# EAGLE design ZED-F9P_NEO-D9S_Combo (EAGLE 9.6.2)
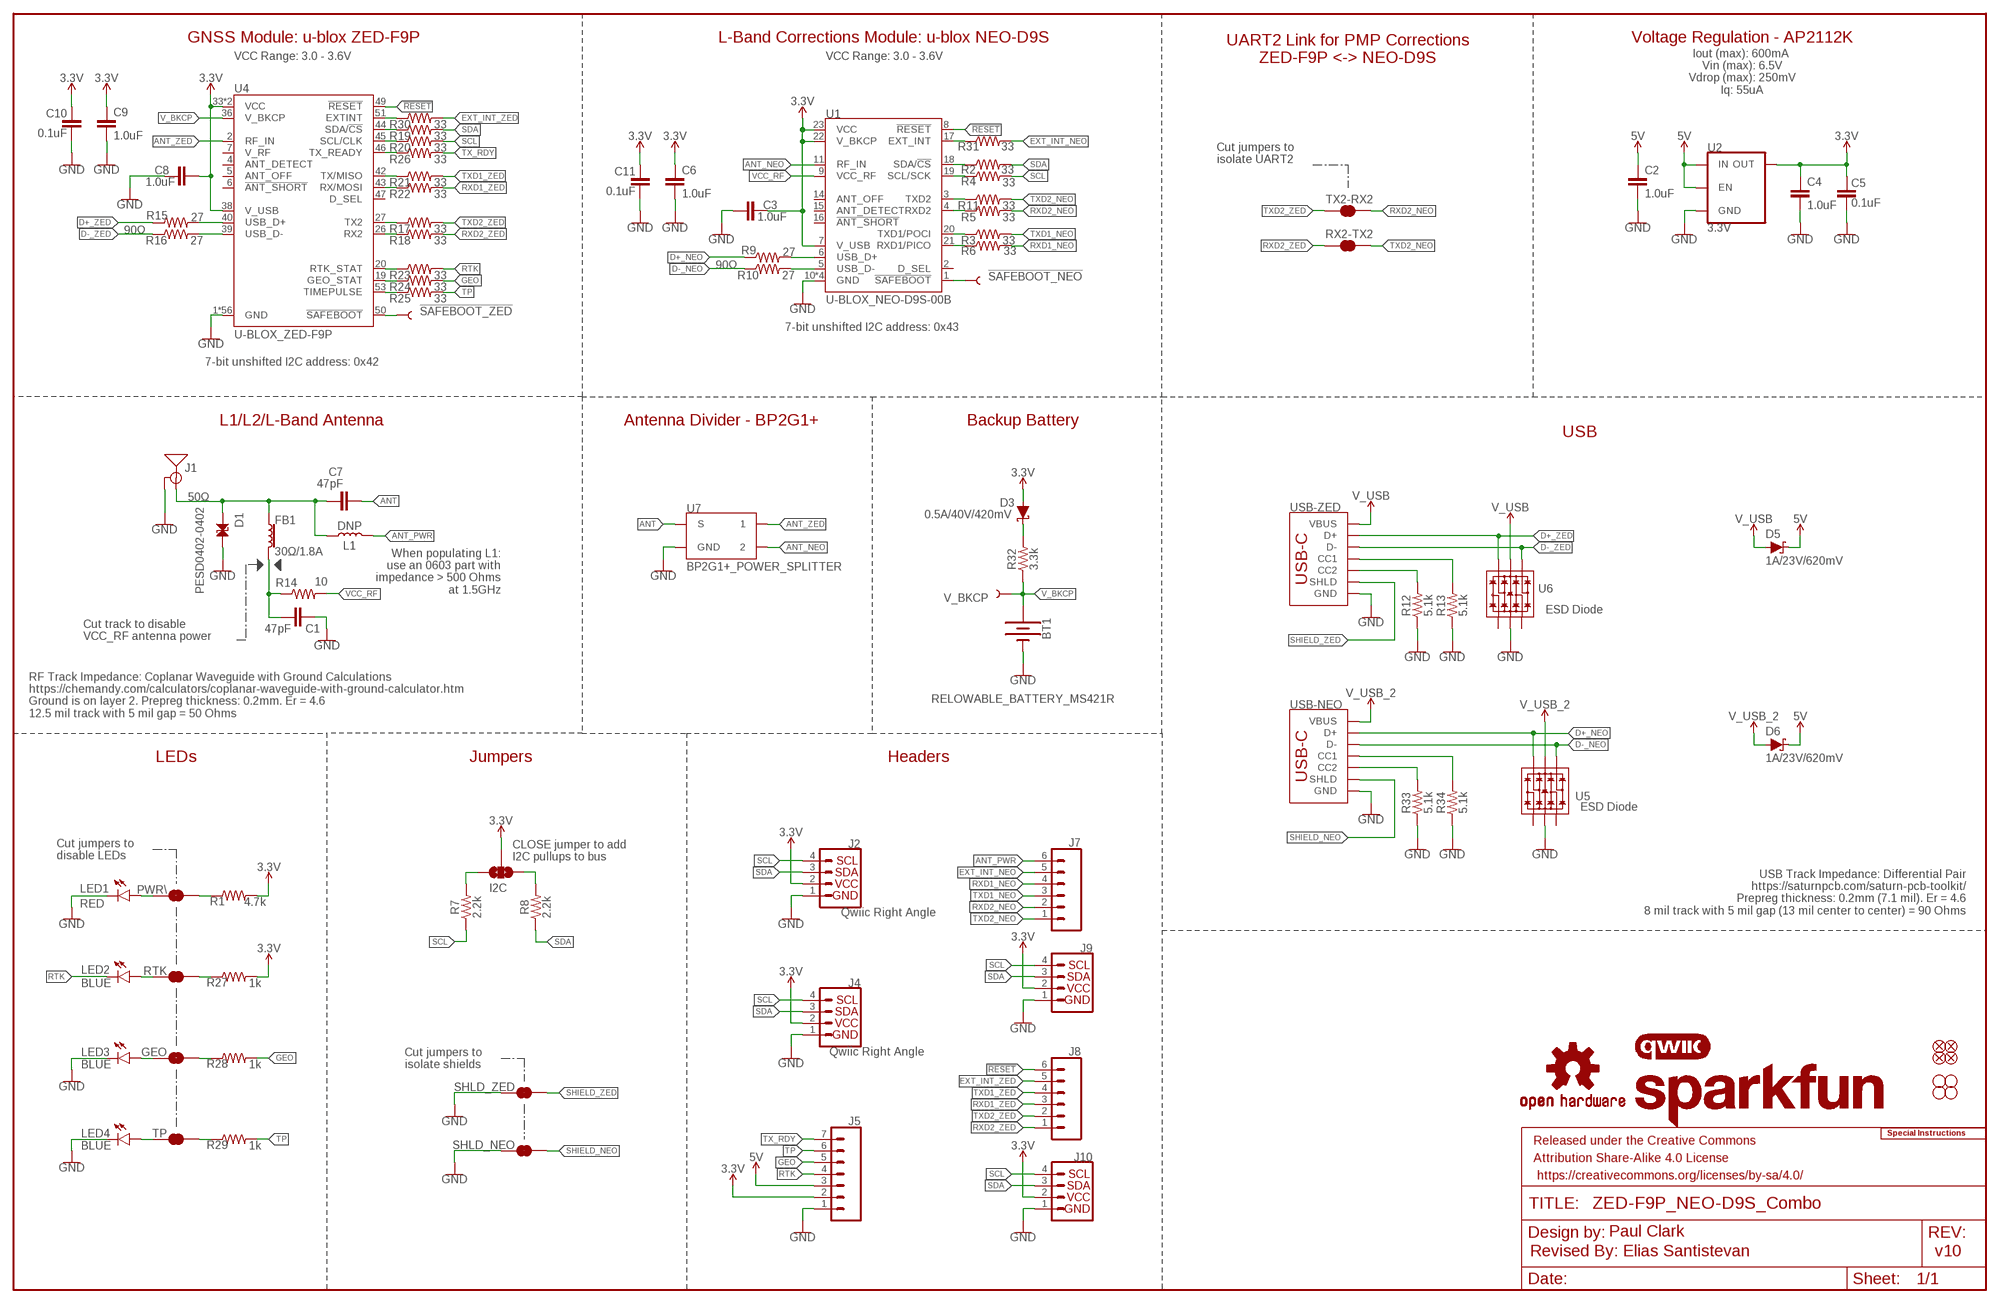
[diagram p0: schematic, sheet 1]

## Parts
!SAFEBOOT_NEO!  TEST-POINTPOGO_PTH  [1X01_NO_SILK]
!SAFEBOOT_ZED!  TEST-POINTPOGO_PTH  [1X01_NO_SILK]
BT1  RELOWABLE_BATTERY_MS421R  [MS421R_IV03E]
C1  47pF  47PF-0603-50V-5%  [0603]
C2  1.0uF  1.0UF-0603-16V-10%  [0603]
C3  1.0uF  1.0UF-0603-16V-10%  [0603]
C4  1.0uF  1.0UF-0603-16V-10%  [0603]
C5  0.1uF  0.1UF-0603-25V-(+80/-20%)  [0603]
C6  1.0uF  1.0UF-0603-16V-10%  [0603]
C7  47pF  47PF-0603-50V-5%  [0603]
C8  1.0uF  1.0UF-0603-16V-10%  [0603]
C9  1.0uF  1.0UF-0603-16V-10%  [0603]
C10  0.1uF  0.1UF-0603-25V-(+80/-20%)  [0603]
C11  0.1uF  0.1UF-0603-25V-(+80/-20%)  [0603]
D1  PESD0402-0402  [0402]
D3  0.5A/40V/420mV  DIODE-SCHOTTKY-PMEG4005EJ  [SOD-323]
D5  1A/23V/620mV  DIODE-SCHOTTKY-BAT20J  [SOD-323]
D6  1A/23V/620mV  DIODE-SCHOTTKY-BAT20J  [SOD-323]
FB1  30Ω/1.8A  FERRITE_BEAD-0603  [0603]
FRAME2  FRAME-LEDGER  [CREATIVE_COMMONS]
GEO  JUMPER-SMT_2_NC_TRACE_SILK  [SMT-JUMPER_2_NC_TRACE_SILK]
I2C  JUMPER-SMT_3_NO_SILK  [SMT-JUMPER_3_NO_SILK]
J1  ANTENNA-SMA-GROUNDEDEDGE_SMA  [SMA-EDGE]
J2  Qwiic Right Angle  I2C_STANDARDQWIIC  [JST04_1MM_RA]
J4  Qwiic Right Angle  I2C_STANDARDQWIIC  [JST04_1MM_RA]
J5  CONN_07NO_SILK  [1X07_NO_SILK]
J7  CONN_06NO_SILK_NO_POP  [1X06_NO_SILK]
J8  CONN_06NO_SILK_NO_POP  [1X06_NO_SILK]
J9  I2C_STANDARD_NO_SILK  [1X04_NO_SILK]
J10  I2C_STANDARD_NO_SILK  [1X04_NO_SILK]
JP21  FIDUCIALUFIDUCIAL  [MICRO-FIDUCIAL]
JP31  STAND-OFF  [STAND-OFF]
JP41  STAND-OFF  [STAND-OFF]
JP61  FIDUCIALUFIDUCIAL  [MICRO-FIDUCIAL]
JP71  FIDUCIALUFIDUCIAL  [MICRO-FIDUCIAL]
JP81  FIDUCIALUFIDUCIAL  [MICRO-FIDUCIAL]
JP91  STAND-OFF  [STAND-OFF]
JP101  STAND-OFF  [STAND-OFF]
L1  DNP  DNP-0603_NO-CREAM  [0603_NO-CREAM]
LED1  RED  LED-RED_0603-KB  [LED-0603]
LED2  BLUE  LED-BLUE0603  [LED-0603]
LED3  BLUE  LED-BLUE0603  [LED-0603]
LED4  BLUE  LED-BLUE0603  [LED-0603]
LOGO2  SFE_LOGO_NAME.1_INCH  [SFE_LOGO_NAME_.1]
LOGO3  QWIIC_LOGO_5MM  [QWIIC_5MM]
LOGO4  OSHW-LOGOS  [OSHW-LOGO-S]
LOGO5  SPECIAL_INSTRUCTIONS-ORDERING  [ORDERING_INSTRUCTIONS]
PWR\  JUMPER-SMT_2_NC_TRACE_SILK  [SMT-JUMPER_2_NC_TRACE_SILK]
R1  4.7k  4.7KOHM-0603-1/10W-1%  [0603]
R2  33  33OHM-0603-1/10W-1%  [0603]
R3  33  33OHM-0603-1/10W-1%  [0603]
R4  33  33OHM-0603-1/10W-1%  [0603]
R5  33  33OHM-0603-1/10W-1%  [0603]
R6  33  33OHM-0603-1/10W-1%  [0603]
R7  2.2k  2.2KOHM-0603-1/10W-1%  [0603]
R8  2.2k  2.2KOHM-0603-1/10W-1%  [0603]
R9  27  27OHM-0603-1/10W-1%  [0603]
R10  27  27OHM-0603-1/10W-1%  [0603]
R11  33  33OHM-0603-1/10W-1%  [0603]
R12  5.1k  5.1KOHM5.1KOHM-0603-1/10W-1%  [0603]
R13  5.1k  5.1KOHM5.1KOHM-0603-1/10W-1%  [0603]
R14  10  10OHM-0603-1/10W-1%  [0603]
R15  27  27OHM-0603-1/10W-1%  [0603]
R16  27  27OHM-0603-1/10W-1%  [0603]
R17  33  33OHM-0603-1/10W-1%  [0603]
R18  33  33OHM-0603-1/10W-1%  [0603]
R19  33  33OHM-0603-1/10W-1%  [0603]
R20  33  33OHM-0603-1/10W-1%  [0603]
R21  33  33OHM-0603-1/10W-1%  [0603]
R22  33  33OHM-0603-1/10W-1%  [0603]
R23  33  33OHM-0603-1/10W-1%  [0603]
R24  33  33OHM-0603-1/10W-1%  [0603]
R25  33  33OHM-0603-1/10W-1%  [0603]
R26  33  33OHM-0603-1/10W-1%  [0603]
R27  1k  1KOHM-0603-1/10W-1%  [0603]
R28  1k  1KOHM-0603-1/10W-1%  [0603]
R29  1k  1KOHM-0603-1/10W-1%  [0603]
R30  33  33OHM-0603-1/10W-1%  [0603]
R31  33  33OHM-0603-1/10W-1%  [0603]
R32  3.3k  3.3KOHM-0603-1/10W-1%  [0603]
R33  5.1k  5.1KOHM5.1KOHM-0603-1/10W-1%  [0603]
R34  5.1k  5.1KOHM5.1KOHM-0603-1/10W-1%  [0603]
RTK  JUMPER-SMT_2_NC_TRACE_SILK  [SMT-JUMPER_2_NC_TRACE_SILK]
RX2-TX2  JUMPER-SMT_2_NC_TRACE_SILK  [SMT-JUMPER_2_NC_TRACE_SILK]
SHLD_NEO  JUMPER-SMT_2_NC_TRACE_SILK  [SMT-JUMPER_2_NC_TRACE_SILK]
SHLD_ZED  JUMPER-SMT_2_NC_TRACE_SILK  [SMT-JUMPER_2_NC_TRACE_SILK]
TP  JUMPER-SMT_2_NC_TRACE_SILK  [SMT-JUMPER_2_NC_TRACE_SILK]
TX2-RX2  JUMPER-SMT_2_NC_TRACE_SILK  [SMT-JUMPER_2_NC_TRACE_SILK]
U1  U-BLOX_NEO-D9S-00B  [NEO-M9N/M8T/M8U/D9S]
U2  3.3V  V_REG_AP2112K-3.3V  [SOT23-5]
U4  U-BLOX_ZED-F9P  [ZED-F9P]
U5  ESD Diode  TVS_DIODE_ARRAY_DT1042-04SO-7  [SOT-23-6]
U6  ESD Diode  TVS_DIODE_ARRAY_DT1042-04SO-7  [SOT-23-6]
U7  BP2G1+_POWER_SPLITTER  [XX21]
USB-NEO  USB Female Type C Connector  USB_C_4-LAYER_PADS  [USB-C-16P_4LAYER-PADS]
USB-ZED  USB Female Type C Connector  USB_C_4-LAYER_PADS  [USB-C-16P_4LAYER-PADS]
V_BKCP  TEST-POINT3X5  [PAD.03X.05]

## Nets
3.3V [3.3V]: C3.1 C4.1 C5.2 C6.1 C8.2 C9.1 C10.2 C11.2 D3.A I2C.2 J2.2 J4.2 J5.2 J9.2 J10.2 R1.2 R27.2 U1.7(V_USB) U1.22(V_BKCP) U1.23(VCC) U2.5(OUT) U4.33(VCC) U4.34(VCC) U4.38(V_USB)
5V: C2.1 D5.C D6.C J5.3 U2.1(IN) U2.3(EN)
!RESET!: J8.6 U1.8(!RESET!) U4.49(!RESET!)
!SAFEBOOT_NEO!: !SAFEBOOT_NEO!.1 U1.1(!SAFEBOOT!)
!SAFEBOOT_ZED!: !SAFEBOOT_ZED!.1 U4.50(!SAFEBOOT!)
ANT: C7.2 U7.2(S)
ANT_NEO: U1.11(RF_IN) U7.5
ANT_PWR: J7.6 L1.2
ANT_VCC: C1.1 FB1.2 R14.1
ANT_ZED: U4.2(RF_IN) U7.8
D+_NEO [DiffPair]: R9.1 U5.6(IO4) USB-NEO.A6(D+) USB-NEO.B6(D+)
D+_ZED [DiffPair]: R15.1 U6.6(IO4) USB-ZED.A6(D+) USB-ZED.B6(D+)
D-_NEO [DiffPair]: R10.1 U5.4(IO3) USB-NEO.A7(D-) USB-NEO.B7(D-)
D-_ZED [DiffPair]: R16.1 U6.4(IO3) USB-ZED.A7(D-) USB-ZED.B7(D-)
EXT_INT_NEO: J7.5 R31.2
EXT_INT_ZED: J8.5 R30.2
GEO: J5.5 R24.2 R28.2
GND: BT1.- C1.2 C2.2 C3.2 C4.2 C5.1 C6.2 C8.1 C9.2 C10.1 C11.1 D1.2 J1.GND@0(GND) J1.GND@1(GND) J1.GND@2(GND) J1.GND@3(GND) J2.1 J4.1 J5.1 J9.1 J10.1 LED1.C LED3.C LED4.C R12.1 R13.1 R33.1 R34.1 SHLD_NEO.1 SHLD_ZED.1 U1.10(GND) U1.12(GND) U1.13(GND) U1.24(GND) U2.2(GND) U4.1(GND) U4.3(GND) U4.12(GND) U4.14(GND) U4.32(GND) U4.37(GND) U4.41(GND) U4.48(GND) U4.55(GND) U4.56(GND) U4.57(GND) U4.58(GND) U4.59(GND) U4.60(GND) U4.61(GND) U4.62(GND) U4.63(GND) U4.64(GND) U4.65(GND) U4.66(GND) U4.67(GND) U4.68(GND) U4.69(GND) U4.70(GND) U4.71(GND) U4.72(GND) U4.73(GND) U4.74(GND) U4.75(GND) U4.76(GND) U4.77(GND) U4.78(GND) U4.79(GND) U4.80(GND) U4.81(GND) U4.82(GND) U4.83(GND) U4.84(GND) U4.85(GND) U4.86(GND) U4.87(GND) U4.88(GND) U4.89(GND) U4.90(GND) U4.91(GND) U4.92(GND) U4.93(GND) U4.94(GND) U4.95(GND) U4.96(GND) U4.97(GND) U4.98(GND) U4.99(GND) U4.100(GND) U4.101(GND) U4.102(GND) U5.2(VSS) U6.2(VSS) U7.1(GND) U7.3(GND) U7.4(GND) U7.6(GND) U7.7(GND) USB-NEO.GND USB-NEO.GND2(GND) USB-ZED.GND USB-ZED.GND2(GND)
N$1: PWR\.2 R1.1
N$2: R3.1 U1.20(TXD1/POCI)
N$3: R2.1 U1.18(SDA/!CS!)
N$4: R4.1 U1.19(SCL/SCK)
N$5: I2C.1 R8.2
N$6: R6.1 U1.21(RXD1/PICO)
N$7: R12.2 USB-ZED.B5(CC2)
N$8: I2C.3 R7.2
N$9: R13.2 USB-ZED.A5(CC1)
N$10: LED1.A PWR\.1
N$11: R9.2 U1.6(USB_D+)
N$12: R10.2 U1.5(USB_D-)
N$13: D3.C R32.2
N$14: R11.1 U1.3(TXD2)
N$15: R5.1 U1.4(RXD2)
N$16: R15.2 U4.40(USB_D+)
N$17: R16.2 U4.39(USB_D-)
N$18: R19.1 U4.44(SDA/!CS!)
N$19: R20.1 U4.45(SCL/CLK)
N$20: R21.1 U4.42(TX/MISO)
N$21: R22.1 U4.43(RX/MOSI)
N$22: R26.1 U4.46(TX_READY)
N$23: LED2.A RTK.1
N$24: R17.1 U4.27(TX2)
N$25: R18.1 U4.26(RX2)
N$26: GEO.1 LED3.A
N$27: LED4.A TP.1
N$28: R27.1 RTK.2
N$29: GEO.2 R28.1
N$30: R29.1 TP.2
N$31: R30.1 U4.51(EXTINT)
N$32: R31.1 U1.17(EXT_INT)
N$33: R33.2 USB-NEO.B5(CC2)
N$34: R34.2 USB-NEO.A5(CC1)
N$35: R23.1 U4.20(RTK_STAT)
N$36: R24.1 U4.19(GEO_STAT)
N$37: R25.1 U4.53(TIMEPULSE)
RTK: J5.4 LED2.C R23.2
RXD1_NEO: J7.4 R6.2
RXD1_ZED: J8.3 R22.2
RXD2_NEO: J7.2 R5.2 TX2-RX2.2
RXD2_ZED: J8.1 R18.2 RX2-TX2.1
SCL: J2.4 J4.4 J9.4 J10.4 R4.2 R7.1 R20.2
SDA: J2.3 J4.3 J9.3 J10.3 R2.2 R8.1 R19.2
SHIELD_NEO: SHLD_NEO.2 USB-NEO.SHLD1(SHLD) USB-NEO.SHLD2(SHLD) USB-NEO.SHLD3(SHLD) USB-NEO.SHLD4(SHLD)
SHIELD_ZED: SHLD_ZED.2 USB-ZED.SHLD1(SHLD) USB-ZED.SHLD2(SHLD) USB-ZED.SHLD3(SHLD) USB-ZED.SHLD4(SHLD)
SMA: C7.1 D1.1 FB1.1 J1.SIG(SIGNAL) L1.1
TP: J5.6 R25.2 R29.2
TX_RDY: J5.7 R26.2
TXD1_NEO: J7.3 R3.2
TXD1_ZED: J8.4 R21.2
TXD2_NEO: J7.1 R11.2 RX2-TX2.2
TXD2_ZED: J8.2 R17.2 TX2-RX2.1
V_BKCP: BT1.+ R32.1 U4.36(V_BKCP) V_BKCP.1
V_USB: D5.A U6.5(VCC) USB-ZED.VBUS1(VBUS) USB-ZED.VBUS2(VBUS)
V_USB_2: D6.A U5.5(VCC) USB-NEO.VBUS1(VBUS) USB-NEO.VBUS2(VBUS)
VCC_RF: R14.2 U1.9(VCC_RF)
Unconnected: U1.2(D_SEL) U1.14(ANT_OFF) U1.15(ANT_DETECT) U1.16(!ANT_SHORT!) U4.4(ANT_DETECT) U4.5(ANT_OFF) U4.6(!ANT_SHORT!) U4.7(V_RF) U4.47(D_SEL) U5.1(IO1) U5.3(IO2) U6.1(IO1) U6.3(IO2)

## Notes on the sheet
- GNSS Module: u-blox ZED-F9P | L-Band Corrections Module: u-blox NEO-D9S | Voltage Regulation - AP2112K
- UART2 Link for PMP Corrections
  ZED-F9P <-> NEO-D9S
- VCC Range: 3.0 - 3.6V | VCC Range: 3.0 - 3.6V
- Iout (max): 600mA 
  Vin (max): 6.5V
  Vdrop (max): 250mV
  Iq: 55uA
- Cut jumpers to
  isolate UART2
- 90Ω
- 90Ω
- 7-bit unshifted I2C address: 0x43
- 7-bit unshifted I2C address: 0x42
- L1/L2/L-Band Antenna | Antenna Divider - BP2G1+ | Backup Battery
- USB
- 50Ω
- When populating L1:
  use an 0603 part with
  impedance > 500 Ohms
  at 1.5GHz
- Cut track to disable
  VCC_RF antenna power
- RF Track Impedance: Coplanar Waveguide with Ground Calculations
  https://chemandy.com/calculators/coplanar-waveguide-with-ground-calculator.htm
  Ground is on layer 2. Prepreg thickness: 0.2mm. Er = 4.6
  12.5 mil track with 5 mil gap = 50 Ohms
- LEDs | Jumpers | Headers
- Cut jumpers to 
  disable LEDs
- CLOSE jumper to add
  I2C pullups to bus
- USB Track Impedance: Differential Pair
  https://saturnpcb.com/saturn-pcb-toolkit/
  Prepreg thickness: 0.2mm (7.1 mil). Er = 4.6
  8 mil track with 5 mil gap (13 mil center to center) = 90 Ohms
- Cut jumpers to 
  isolate shields
- Paul Clark
- Revised By: Elias Santistevan | v10

## Library data of the parts
!SAFEBOOT_NEO! !SAFEBOOT_ZED! V_BKCP = SparkFun-Connectors:TEST-POINT: SparkFun Test Points Bare copper test points for troubleshooting or In-Circuit-Testing. These are used by our Production team for verifying production board runs using pogo-pins on test beds. SparkFun Products: SparkFun LSM9DS1 Breakout <https://www.sparkfun.com/products/13284> SparkFun PSOC <https://www.sparkfun.com/products/13714> SparkFun Load Cell Amplifier <https://www.sparkfun.com/products/13879>
BT1 = SparkFun-Batteries:RELOWABLE_BATTERY: SEIKO Reflowable Lithium Batteries; PROD_ID: BAT-16685
C1 C7 = SparkFun-Capacitors:47PF: 47pF ceramic capacitors A capacitor is a passive two-terminal electrical component used to store electrical energy temporarily in an electric field.; PROD_ID: CAP-08913
C2-C4 C6 C8 C9 = SparkFun-Capacitors:1.0UF: 1µF ceramic capacitors A capacitor is a passive two-terminal electrical component used to store electrical energy temporarily in an electric field.; PROD_ID: CAP-00868
C5 C10 C11 = SparkFun-Capacitors:0.1UF: 0.1µF ceramic capacitors A capacitor is a passive two-terminal electrical component used to store electrical energy temporarily in an electric field.; PROD_ID: CAP-00810
D1 = SparkFun-DiscreteSemi:PESD0402: ESD protection diode PESD is used to protect a signal line from ESD.; DIGIKEY_PART: PESD0402-140CT-ND; MOUSE_PART: 650-PESD0402-140; PROD_ID: DIO-15359
D3 = SparkFun-DiscreteSemi:DIODE-SCHOTTKY: Schottky diode A Schottky diode is a semiconductor diode which has a low forward voltage drop and a very fast switching action.; PROD_ID: DIO-10955
D5 D6 = SparkFun-DiscreteSemi:DIODE-SCHOTTKY: Schottky diode A Schottky diode is a semiconductor diode which has a low forward voltage drop and a very fast switching action.; PROD_ID: DIO-11623
FB1 = SparkFun-Coils:FERRITE_BEAD: Ferrite Bead (blocks, cores, rings, chokes, etc.) Inductor with layers of ferrite used to suppress high frequencies. Often used to isolate high frequency noise. SparkFun Products: IOIO-OTG - V2.2 <https://www.sparkfun.com/products/13613> SparkFun SAMD21 Mini Breakout <https://www.sparkfun.com/products/13664> SparkFun 6 Degrees of Freedom Breakout - LSM6DS3 <https://www.sparkfun.com/products/13339> SparkFun SAMD21 Dev Breakout <https://www.sparkfun.com/products/13672> Lilypad MP3 <https://www.sparkfun.com/products/11013>; PROD_ID: NDUC-13805
FRAME2 = SparkFun-Aesthetics:FRAME-LEDGER: Schematic Frame - Ledger Standard 11x14 US Ledger frame
GEO PWR\ RTK RX2-TX2 SHLD_NEO SHLD_ZED TP TX2-RX2 = SparkFun-Jumpers:JUMPER-SMT_2_NC_TRACE: Normally closed trace jumper This jumper has a trace between two pads so it's normally closed (NC). Use a razor knife to open the connection. For best results follow the IPC guidelines for cutting traces: Cutout at least 0.063 mm (0.005 in). Remove all loose material to clean up the cut area. Seal the cut with an approved epoxy. Reapply solder to reclose the connection.
I2C = SparkFun-Jumpers:JUMPER-SMT_3_NO: Normally open jumper This jumper has three pads in close proximity to each other. Apply solder to close the connection(s).
J1 = SparkFun-RF:ANTENNA-SMA-GROUNDED: SMA Antenna Connector w/ Ground Edge-mount and SMD SMA connectors for RF Antennas. **4-LAYER BOARD WARNING!!** When designing a 4-layer board using any of the SMD variants, you will need to manually add a cutout polygon on any internal power layers to make sure that you don't end up with exposed copper around the edge of the routed hole for these connectors. Exposed power copper could then short to the connector body - and that would be bad. Why hasn't anyone added the cutout polygons directly to the connector footprint? Well, your internal layers (usually 2 and 15) may be covered with GND polygons and you might well want the copper to go all the way to the edge, especially under the connector SIGNAL pin. So adding cutouts to the footprint might make matters worse, not better...; PROD_ID: CONN-08289
J2 J4 = SparkFun-Connectors:I2C_STANDARD: SparkFun I2C Standard Pinout Header SparkFun has standardized on a pinout for all I2C based sensor breakouts. This pinout allows I2C boards to be plugged directly into the headers on Arduino Uno compatible boards, and to be daisy chained easily. Example SparkFun Products: SparkFun Atmospheric Sensor Breakout - BME280 <https://www.sparkfun.com/products/13676> SparkFun Altitude/Pressure Sensor Breakout - MPL3115A2 <https://www.sparkfun.com/products/11084> SparkFun TOF Range Finder Sensor - VL6180 <https://www.sparkfun.com/products/12785>; PROD_ID: CONN-13694
J5 = SparkFun-Connectors:CONN_07: Multi connection point. Often used as Generic Header-pin footprint for 0.1 inch spaced/style header connections On any of the 0.1 inch spaced packages, you can populate with these: Break Away Headers - Straight <https://www.sparkfun.com/products/116> (PRT-00116) Break Away Male Headers - Right Angle <https://www.sparkfun.com/products/553> (PRT-00553) Female Headers <https://www.sparkfun.com/products/115> (PRT-00115) Break Away Headers - Machine Pin <https://www.sparkfun.com/products/117> (PRT-00117) Break Away Female Headers - Swiss Machine Pin <https://www.sparkfun.com/products/743> (PRT-00743) For SCREWTERMINALS and SPRING TERMINALS visit here: Screw Terimnals on SparkFun.com <https://www.sparkfun.com/search/results?term=Screw+Terminals> (5mm/3.5mm/2.54mm spacing) This device is also useful as a general connection point to wire up your design to another part of your project. Our various solder wires solder well into these plated through hole pads. Hook-Up Wire - Assortment (Stranded, 22 AWG) <https://www.sparkfun.com/products/11375> (PRT-11375) Hook-Up Wire - Assortment (Solid Core, 22 AWG) <https://www.sparkfun.com/products/11367> (PRT-11367) View the entire wire category on our website here <https://www.sparkfun.com/categories/141> Special notes: Molex polarized connector foot print use with SKU : PRT-08231 with associated crimp pins and housings. 1MM SMD Version SKU: PRT-10208 NOTES ON THE VARIANTS LOCK and LOCK_LONGPADS... This footprint was designed to help hold the alignment of a through-hole component (i.e. 6-pin header) while soldering it into place. You may notice that each hole has been shifted either up or down by 0.005 of an inch from it's more standard position (which is a perfectly straight line). This slight alteration caused the pins (the squares in the middle) to touch the edges of the holes. Because they are alternating, it causes a "brace" to hold the component in place. 0.005 has proven to be the perfect amount of "off-center" position when using our standard breakaway headers. Although looks a little odd when you look at the bare footprint, once you have a header in there, the alteration is very hard to notice. Also,if you push a header all the way into place, it is covered up entirely on the bottom side.
J7 J8 = SparkFun-Connectors:CONN_06: Multi connection point. Often used as Generic Header-pin footprint for 0.1 inch spaced/style header connections On any of the 0.1 inch spaced packages, you can populate with these: Break Away Headers - Straight <https://www.sparkfun.com/products/116> (PRT-00116) Break Away Male Headers - Right Angle <https://www.sparkfun.com/products/553> (PRT-00553) Female Headers <https://www.sparkfun.com/products/115> (PRT-00115) Break Away Headers - Machine Pin <https://www.sparkfun.com/products/117> (PRT-00117) Break Away Female Headers - Swiss Machine Pin <https://www.sparkfun.com/products/743> (PRT-00743) Arduino Stackable Header - 6 Pin <https://www.sparkfun.com/products/9280> (PRT-09280) Screw Terminals 2.54mm Pitch (6-Pin) <https://www.sparkfun.com/products/16499> (PRT-16499) For SCREWTERMINALS and SPRING TERMINALS visit here: Screw Terimnals on SparkFun.com <https://www.sparkfun.com/search/results?term=Screw+Terminals> (5mm/3.5mm/2.54mm spacing) This device is also useful as a general connection point to wire up your design to another part of your project. Our various solder wires solder well into these plated through hole pads. Hook-Up Wire - Assortment (Stranded, 22 AWG) <https://www.sparkfun.com/products/11375> (PRT-11375) Hook-Up Wire - Assortment (Solid Core, 22 AWG) <https://www.sparkfun.com/products/11367> (PRT-11367) View the entire wire category on our website here <https://www.sparkfun.com/categories/141>
J9 J10 = SparkFun-Connectors:I2C_STANDARD: SparkFun I2C Standard Pinout Header SparkFun has standardized on a pinout for all I2C based sensor breakouts. This pinout allows I2C boards to be plugged directly into the headers on Arduino Uno compatible boards, and to be daisy chained easily. Example SparkFun Products: SparkFun Atmospheric Sensor Breakout - BME280 <https://www.sparkfun.com/products/13676> SparkFun Altitude/Pressure Sensor Breakout - MPL3115A2 <https://www.sparkfun.com/products/11084> SparkFun TOF Range Finder Sensor - VL6180 <https://www.sparkfun.com/products/12785>
JP21 JP61 JP71 JP81 = SparkFun:FIDUCIAL: Fiducial Alignment Points Various fiducial points for machine vision alignment.
JP31 JP41 JP91 JP101 = SparkFun:STAND-OFF: Stand Off This is the mechanical footprint for a #4 phillips button head screw. Use the keepout ring to avoid running the screw head into surrounding components. SKU : PRT-00447
L1 = SparkFun-Coils:DNP
LED1 = SparkFun-LED:LED-RED: Red SMD LED Used in manufacturing of most products at SparkFun Packages: 0603 - KB - KingBright (DIO-17976) SMD 0603 package [Datasheet] <https://www.kingbrightusa.com/images/catalog/SPEC/APT1608SURCK.pdf> 0603 - (DIO-00819, has gone EOL) SMD 0603 package 0603 SMART - SMD 0603 SMART package ( more efficient and expensive)[Product Link] <http://www.osram-os.com/Graphics/XPic2/00077099_0.pdf> 1206 - SMD1206 package [Product Link] <https://www.sparkfun.com/datasheets/DevTools/LilyPad/Q150OVS4.pdff> SparkFun Products: Pro Mini 328 -5V <https://www.sparkfun.com/products/821> RedBoard <https://www.sparkfun.com/products/12757> IOIO-OTG <https://www.sparkfun.com/products/13613>; PROD_ID: DIO-17976
LED2-LED4 = SparkFun-LED:LED-BLUE: Blue SMD LED Used in manufacturing of various products at SparkFun Packages: 0603 - SMD 0603 package [Product Link] <http://www.digikey.com/product-detail/en/SMLE12BC7TT86/511-1589-2-ND/1641808> 1206 - SMD1206 package [Product Link] <http://www.digikey.com/product-detail/en/lite-on-inc/LTST-C150TBKT/160-1643-1-ND/573584> SparkFun Products: ESP8266 Thing-Dev Board <https://www.sparkfun.com/products/13711> RedBoard <https://www.sparkfun.com/products/12757>; PROD_ID: DIO-08575
LOGO2 = SparkFun-Aesthetics:SFE_LOGO_NAME: SparkFun Font Logo This is the SparkFun name logo. The logo on the schematic will always be the same size; the package variant is the height of the flame part of the logo (or the height the flame would be, if it were drawn). Default layer for the logo on the board is tSilk.
LOGO3 = SparkFun-Aesthetics:QWIIC_LOGO: Qwiic Logos for placement on schematic and PCB. The 5.5mm silk logo is best for placing next to Qwiic connector.
LOGO4 = SparkFun-Aesthetics:OSHW-LOGO: Open-Source Hardware (OSHW) Logo This logo indicates the piece of hardware it is found on incorporates a OSHW license and/or adheres to the definition of open source hardware found here: http://freedomdefined.org/OSHW
LOGO5 = SparkFun-Aesthetics:SPECIAL_INSTRUCTIONS: Special Ordering/Production Instructions Alert Symbol for special PCB ordering instructions or unique production process warnings. Ordering Instructions Production Instructions Types of information that should be added to box: Copper weight Soldermask color Silk color PCB thickness Number of layers PCB Standard: 1.6mm FR4 1 oz copper immersion silver plating red soldermask white silkscreen Types of information that should be added to box: Special wash requirements Depaneling instructions Humidification Glue curing Default text settings: 0.07 inch 9% ratio 50% line distance
R1 = SparkFun-Resistors:4.7KOHM: 4.7kΩ resistor A resistor is a passive two-terminal electrical component that implements electrical resistance as a circuit element. Resistors act to reduce current flow, and, at the same time, act to lower voltage levels within circuits. - Wikipedia; PROD_ID: RES-07857
R2-R6 R11 R17-R26 R30 R31 = SparkFun-Resistors:33OHM: 33Ω resistor A resistor is a passive two-terminal electrical component that implements electrical resistance as a circuit element. Resistors act to reduce current flow, and, at the same time, act to lower voltage levels within circuits. - Wikipedia; PROD_ID: RES-08270
R7 R8 = SparkFun-Resistors:2.2KOHM: 2.2kΩ resistor A resistor is a passive two-terminal electrical component that implements electrical resistance as a circuit element. Resistors act to reduce current flow, and, at the same time, act to lower voltage levels within circuits. - Wikipedia; PROD_ID: RES-08272
R9 R10 R15 R16 = SparkFun-Resistors:27OHM: 27Ω resistor A resistor is a passive two-terminal electrical component that implements electrical resistance as a circuit element. Resistors act to reduce current flow, and, at the same time, act to lower voltage levels within circuits. - Wikipedia; PROD_ID: RES-09334
R12 R13 R33 R34 = SparkFun-Resistors:5.1KOHM; PROD_ID: RES-12083
R14 = SparkFun-Resistors:10OHM: 10Ω resistor A resistor is a passive two-terminal electrical component that implements electrical resistance as a circuit element. Resistors act to reduce current flow, and, at the same time, act to lower voltage levels within circuits. - Wikipedia; PROD_ID: RES-12581
R27-R29 = SparkFun-Resistors:1KOHM: 1kΩ resistor A resistor is a passive two-terminal electrical component that implements electrical resistance as a circuit element. Resistors act to reduce current flow, and, at the same time, act to lower voltage levels within circuits. - Wikipedia; PROD_ID: RES-07856
R32 = SparkFun-Resistors:3.3KOHM: 3.3kΩ resistor A resistor is a passive two-terminal electrical component that implements electrical resistance as a circuit element. Resistors act to reduce current flow, and, at the same time, act to lower voltage levels within circuits. - Wikipedia; PROD_ID: RES-07851
U1 = SparkFun-GPS:U-BLOX_NEO-D9S: u-blox NEO-D9S The NEO-D9S can receive the data stream of a GNSS correction service, broadcast via satellite L band and compliant to the specification the product is designed for. Integrated with a high precision GNSS receiver, such as from the u-blox F9 platform, it enables the positioning system to reach down to centimeter-level accuracy.; PROD_ID: IC-16579
U2 = SparkFun-IC-Power:V_REG_AP2112: AP2112 - 600mA CMOS LDO Regulator w/ Enable The AP2112 is CMOS process low dropout linear regulator with enable function, the regulator delivers a guaranteed 600mA (min.) continuous load current. Features Output Voltage Accuracy: ±1.5% Output Current: 600mA (Min.) Foldback Short Current Protection: 50mA Enable Function to Turn ON/OFF VOUT Low Dropout Voltage (3.3V): 250mV (Typ.) @IOUT=600mA Excellent Load Regulation: 0.2%/A (Typ.) Excellent Line Regulation: 0.02%/V (Typ.) Low Quiescent Current: 55μA (Typ.) Low Standby Current: 0.01μA (Typ.) Low Output Noise: 50μVRMS PSRR: 100Hz -65dB, 1kHz -65dB OTSD Protection Stable with 1.0μF Flexible Cap: Ceramic, Tantalum and Aluminum Electrolytic Operation Temperature Range: -40°C to 85°C ESD: MM 400V, HBM 4000V; PROD_ID: VREG-12457
U4 = SparkFun-GPS:U-BLOX_ZED-F9P; PROD_ID: IC-14209
U5 U6 = SparkFun-DiscreteSemi:TVS_DIODE_ARRAY; PROD_ID: IC-13538
U7 = SparkFun-RF:BP2G1+_POWER_SPLITTER: BP2G1+ 2 Ways MMIC DC Pass Power Splitter, 1200 - 2000 MHz, 50Ω; PROD_ID: IC-17198
USB-NEO USB-ZED = SparkFun-Connectors:USB_C: USB Type C 16Pin Connector Super Speed pins not available on the 16-pin purely SMD connector so this part is best for USB 2.0 implementations. D1 and D2 are tied together enabling D+/- no matter which way the cable is plugged into the connector. The two channel configuration pins (CC1/2) are exposed. These are normally connected to ground via 5.1k resistors but can be reconfigured for high current/high power applications. **4-LAYER BOARD WARNING!!** If designing 4-layer board, make sure to select the variant _4-LAYER-ISOLATED. The linked footprint (USB-C-16-4LAYER-ISOLATED) includes some very necessary cutout polygons in the inner layers (2 and 15). This prevents the PTH mounting shield legs on the USB connector from electrically connecting any other polygons on the inner layers (usually VCC and GND).; PROD_ID: CONN-14122

## Net classes
1 vcc: width 0.152 mm
2 3.3V: width 0.508 mm
4 DiffPair: width 0.203 mm, clearance 0.127 mm

## Board
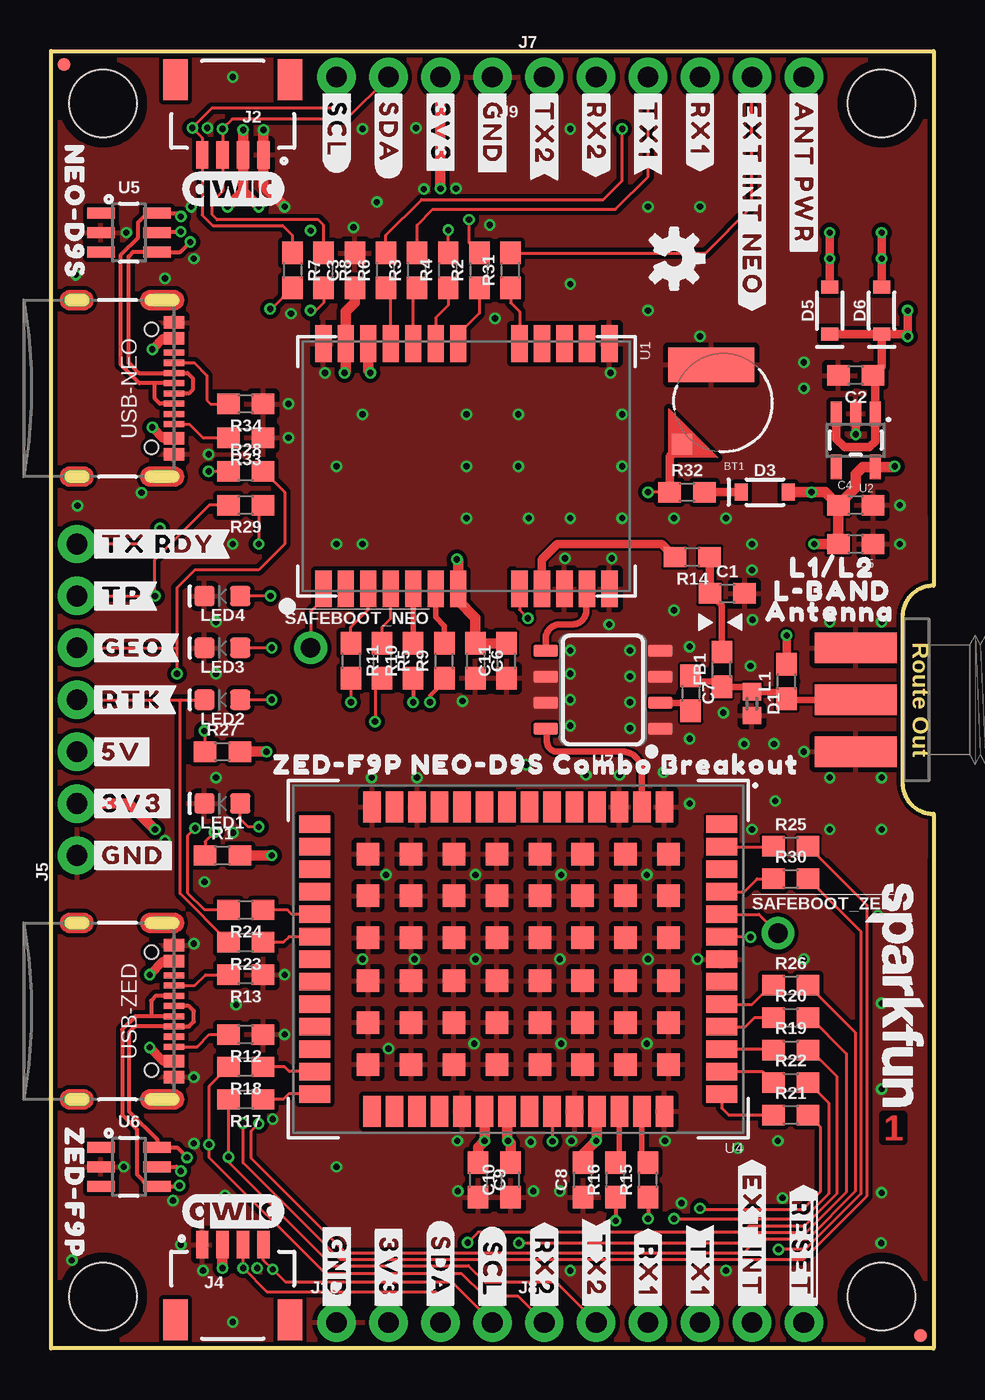
[diagram p1: board, top side]
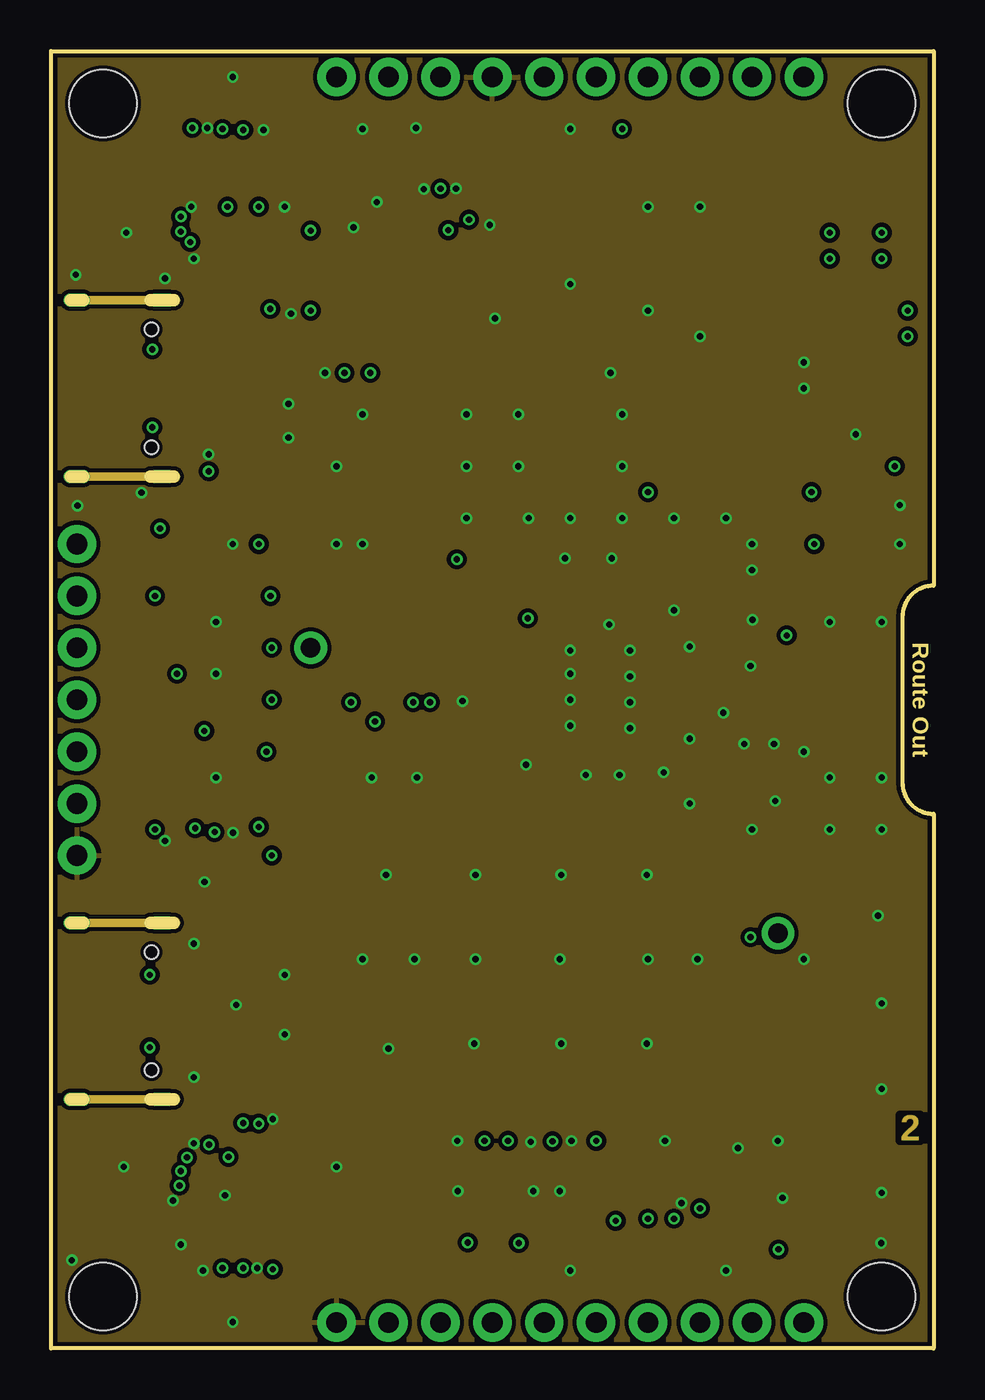
[diagram p2: board, inner layer Route2]
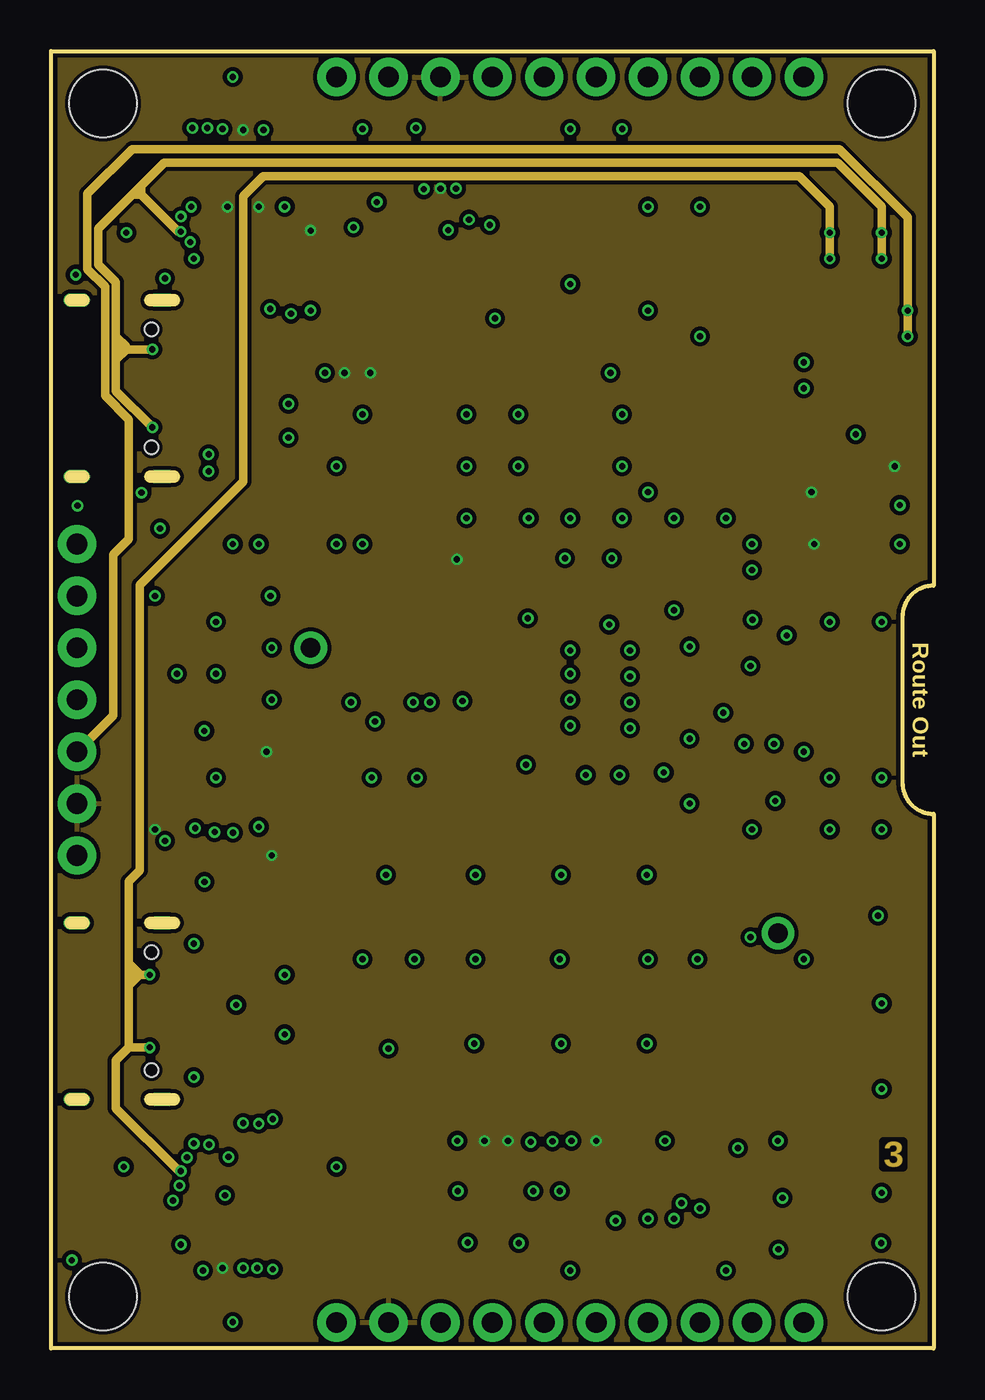
[diagram p3: board, inner layer Route15]
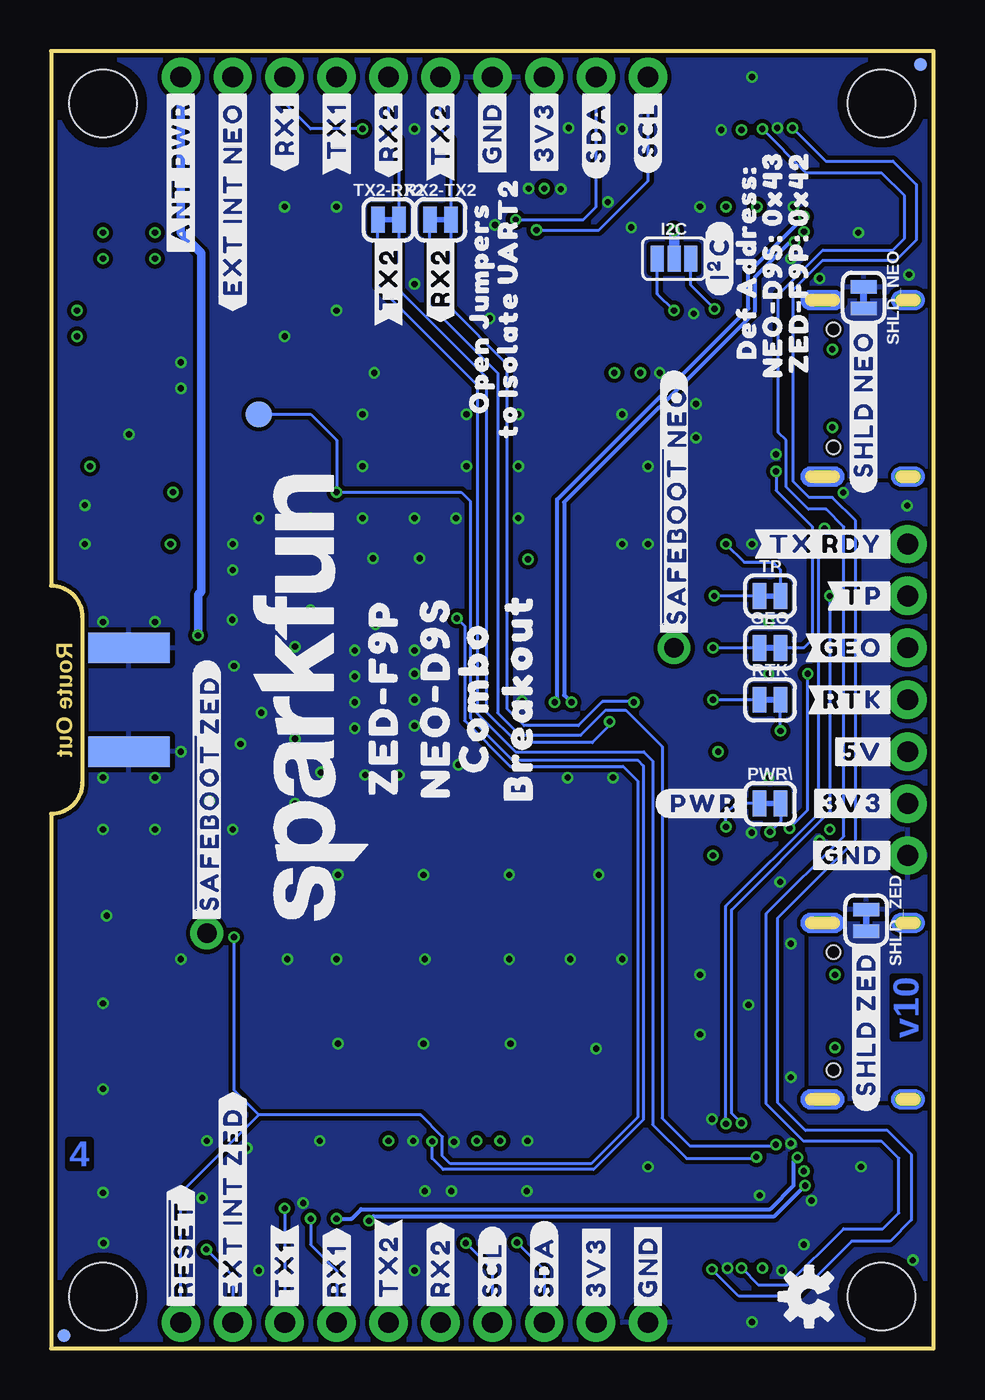
[diagram p4: board, bottom side, seen from below]

Size 43.18 x 63.5 mm. Coordinates in mm from the lower left corner, seen from the top.
Outline: 0,0 0,63.5 43.18,63.5 43.18,37.34 arc90 41.66,35.81 41.66,27.69 arc90 43.18,26.16 43.18,0 0,0
Copper layers (1*2*15*16): Top 0.035559375mm / dielectric 0.47751875mm / Route2 0.035559375mm / dielectric 0.47751875mm / Route15 0.035559375mm / dielectric 0.47751875mm / Bottom 0.035559375mm
Design rules "SparkFun-4-Layer-Minimum-JLCPCB": minimum track width 5mil, minimum drill 0.2mm, track to track 5mil, track to pad 5mil, pad to pad 5mil, via to via 5mil, smd to smd 5mil, copper to edge 7mil, drill to drill 7mil, minimum pad ring 5mil, minimum via ring 5mil, stop-mask expansion 2.5mil, vias tented up to drill 25mil, thermal gap 10mil
tRestrict: 3 lines

### Footprints (pad centres in the part's own frame; a part is rotated, then mirrored left to right if it is on the bottom)
1X01_NO_SILK = drill 0.95 pad 1.6: 1 0,0
MS421R_IV03E = smd 1 x 1: + 2.022,2.032 | smd 4.2 x 1.7: - 0.6,-1.85
0603 = smd 1.1 x 1: 1 -0.85,0; 2 0.85,0
0402 = smd 0.85 x 0.9: 1 -0.58,0; 2 0.58,0
SOD-323 = smd 0.63 x 0.83: A 1.15,0; C -1.15,0
SMT-JUMPER_2_NC_TRACE_SILK = smd 0.66 x 1.27: 1 -0.521,0; 2 0.521,0
SMT-JUMPER_3_NO_SILK = smd 0.635 x 1.27: 1 -0.813,0; 2 0,0; 3 0.813,0
SMA-EDGE = smd 1.5 x 4: GND@0 -2.54,0; GND@1 2.54,0; SIG 0,0 | smd 1.5 x 4 bottom: GND@2 -2.54,0; GND@3 2.54,0
JST04_1MM_RA = smd 0.6 x 1.35: 1 -1.5,0; 2 -0.5,0; 3 0.5,0; 4 1.5,0 | smd 1.2 x 2: NC1 2.8,-3.675; NC2 -2.8,-3.675
1X07_NO_SILK = drill 1.016 pad 1.88: 1 0,0; 2 2.54,0; 3 5.08,0; 4 7.62,0; 5 10.16,0; 6 12.7,0; 7 15.24,0
1X06_NO_SILK = drill 1.016 pad 1.88: 1 0,0; 2 2.54,0; 3 5.08,0; 4 7.62,0; 5 10.16,0; 6 12.7,0
1X04_NO_SILK = drill 1.016 pad 1.88: 1 0,0; 2 2.54,0; 3 5.08,0; 4 7.62,0
MICRO-FIDUCIAL = smd 0.635 x 0.635: 1 0,0
STAND-OFF = hole 3.302: 0,0
0603_NO-CREAM = smd 1.1 x 1: 1 -0.85,0; 2 0.85,0
LED-0603 = smd 1 x 1: A -0.877,0; C 0.877,0
NEO-M9N/M8T/M8U/D9S = smd 1.8 x 0.8: 1 6,-7; 2 6,-5.9; 3 6,-4.8; 4 6,-3.7; 5 6,-2.6; 6 6,-1.5; 7 6,-0.4; 8 6,2.6; 9 6,3.7; 10 6,4.8; 11 6,5.9; 12 6,7; 13 -6,7; 14 -6,5.9; 15 -6,4.8; 16 -6,3.7; 17 -6,2.6; 18 -6,-0.4; 19 -6,-1.5; 20 -6,-2.6; 21 -6,-3.7; 22 -6,-4.8; 23 -6,-5.9; 24 -6,-7
SOT23-5 = smd 0.55 x 1.2: 1 -0.95,-1.3; 2 0,-1.3; 3 0.95,-1.3; 4 0.95,1.3; 5 -0.95,1.3
ZED-F9P = smd 0.85 x 1.52: 1 -7.15,-7.45; 2 -6.05,-7.45; 3 -4.95,-7.45; 4 -3.85,-7.45; 5 -2.75,-7.45; 6 -1.65,-7.45; 7 -0.55,-7.45; 8 0.55,-7.45; 9 1.65,-7.45; 10 2.75,-7.45; 11 3.85,-7.45; 12 4.95,-7.45; 13 6.05,-7.45; 14 7.15,-7.45; 28 7.15,7.45; 29 6.05,7.45; 30 4.95,7.45; 31 3.85,7.45; 32 2.75,7.45; 33 1.65,7.45; 34 0.55,7.45; 35 -0.55,7.45; 36 -1.65,7.45; 37 -2.75,7.45; 38 -3.85,7.45; 39 -4.95,7.45; 40 -6.05,7.45; 41 -7.15,7.45 | smd 1.52 x 0.85: 15 9.95,-6.6; 16 9.95,-5.5; 17 9.95,-4.4; 18 9.95,-3.3; 19 9.95,-2.2; 20 9.95,-1.1; 21 9.95,0; 22 9.95,1.1; 23 9.95,2.2; 24 9.95,3.3; 25 9.95,4.4; 26 9.95,5.5; 27 9.95,6.6; 42 -9.95,6.6; 43 -9.95,5.5; 44 -9.95,4.4; 45 -9.95,3.3; 46 -9.95,2.2; 47 -9.95,1.1; 48 -9.95,0; 49 -9.95,-1.1; 50 -9.95,-2.2; 51 -9.95,-3.3; 52 -9.95,-4.4; 53 -9.95,-5.5; 54 -9.95,-6.6 | smd 1.1 x 1.1: 55 -1.05,-1.05; 56 -3.15,-1.05; 57 -5.25,-1.05; 58 -7.35,-1.05; 59 -1.05,-3.1; 60 -3.15,-3.1; 61 -5.25,-3.1; 62 -7.35,-3.1; 63 -1.05,-5.15; 64 -3.15,-5.15; 65 -5.25,-5.15; 66 -7.35,-5.15; 67 -1.05,5.15; 68 -3.15,5.15; 69 -5.25,5.15; 70 -7.35,5.15; 71 -1.05,3.1; 72 -3.15,3.1; 73 -5.25,3.1; 74 -7.35,3.1; 75 -1.05,1.05; 76 -3.15,1.05; 77 -5.25,1.05; 78 -7.35,1.05; 79 1.05,1.05; 80 3.15,1.05; 81 5.25,1.05; 82 7.35,1.05; 83 1.05,3.1; 84 3.15,3.1; 85 5.25,3.1; 86 7.35,3.1; 87 1.05,5.15; 88 3.15,5.15; 89 5.25,5.15; 90 7.35,5.15; 91 1.05,-5.15; 92 3.15,-5.15; 93 5.25,-5.15; 94 7.35,-5.15; 95 1.05,-3.1; 96 3.15,-3.1; 97 5.25,-3.1; 98 7.35,-3.1; 99 1.05,-1.05; 100 3.15,-1.05; 101 5.25,-1.05; 102 7.35,-1.05
SOT-23-6 = smd 0.55 x 1.35: 1 -0.95,-1.375; 2 0,-1.375; 3 0.95,-1.375; 4 0.95,1.375; 5 0,1.375; 6 -0.95,1.375
XX21 = smd 0.6 x 1.2: 1 -1.905,-2.8; 2 -0.635,-2.8; 3 0.635,-2.8; 4 1.905,-2.8; 5 1.905,2.8; 6 0.635,2.8; 7 -0.635,2.8; 8 -1.905,2.8
USB-C-16P_4LAYER-PADS = smd 0.3 x 1: A5 -1.25,-0.34; A6 -0.25,-0.34; A7 0.25,-0.34; A8 1.25,-0.34; B5 1.75,-0.34; B6 0.75,-0.34; B7 -0.75,-0.34; B8 -1.75,-0.34 | smd 0.6 x 1: GND -3.225,-0.34; GND2 3.225,-0.34; VBUS1 -2.45,-0.34; VBUS2 2.45,-0.34 | drill 0.4 pad 0.6 long: SHLD1 -4.318,-0.915; SHLD2 4.318,-0.915; SHLD3 -4.318,-5.095; SHLD4 4.318,-5.095 | hole 0.65: -2.89,-1.445; 2.89,-1.445
PAD.03X.05 = smd 1.27 x 1.27: 1 0,0

### Placement (x,y rotation side)
!SAFEBOOT_NEO!  12.7,34.29 0 top
!SAFEBOOT_ZED!  35.56,20.32 0 top
BT1  32.89,46.29 180 top
C1  33.08,36.96 0 top
C2  39.37,47.62 180 top
C3  14.86,52.77 90 top
C4  39.37,41.27 0 top
C5  39.37,39.37 180 top
C6  20.76,33.66 270 top
C7  31.29,32.07 270 top
C8  26.04,8.26 90 top
C9  20.89,8.26 270 top
C10  22.48,8.26 90 top
C11  22.29,33.66 90 top
D1  34.29,31.56 270 top
D3  34.92,41.91 0 top
D5  38.1,50.8 90 top
D6  40.64,50.8 90 top
FB1  32.82,33.24 90 top
FRAME2  72.39,1.27 0 top  (outside the outline)
GEO  8,34.29 0 bottom
I2C  12.7,53.34 0 bottom
J1  39.37,31.75 270 top
J2  8.89,58.42 180 top
J4  8.89,5.08 0 top
J5  1.27,24.13 90 top
J7  24.13,62.23 0 top
J8  24.13,1.27 0 top
J9  21.59,62.23 180 top
J10  13.97,1.27 0 top
JP21  42.55,0.64 0 top
JP31  2.54,60.93 0 top
JP41  40.64,60.93 0 top
JP61  0.64,62.84 0 top
JP71  42.55,0.64 0 bottom
JP81  0.64,62.84 0 bottom
JP91  2.54,2.54 0 top
JP101  40.64,2.54 0 top
L1  35.99,32.64 90 top
LED1  8.38,26.67 180 top
LED2  8.38,31.75 180 top
LED3  8.38,34.29 180 top
LED4  8.38,36.83 180 top
LOGO1  OSHW-LOGOS  [OSHW-LOGO-S]  30.48,53.34 270 top
LOGO2  41.27,17.27 270 top
LOGO3  8.89,6.73 0 top
LOGO4  6.1,2.54 90 bottom
LOGO5  54.61,63.5 0 top  (outside the outline)
LOGO6  QWIIC_LOGO_5MM  [QWIIC_5MM]  8.89,56.77 0 top
PWR\  8,26.67 0 bottom
R1  8.38,24.13 0 top
R2  20.95,52.77 90 top
R3  17.91,52.77 90 top
R4  19.43,52.77 90 top
R5  16.19,33.66 270 top
R6  16.38,52.77 90 top
R7  11.81,52.77 270 top
R8  13.34,52.77 270 top
R9  19.24,33.66 90 top
R10  17.72,33.66 90 top
R11  14.67,33.66 270 top
R12  9.53,15.37 180 top
R13  9.53,18.29 180 top
R14  31.37,38.73 180 top
R15  29.21,8.26 90 top
R16  27.62,8.26 90 top
R17  9.53,12.19 180 top
R18  9.53,13.78 180 top
R19  36.2,14.61 0 top
R20  36.2,16.19 0 top
R21  36.2,11.43 0 top
R22  36.2,13.02 0 top
R23  9.53,19.88 180 top
R24  9.53,21.46 180 top
R25  36.2,24.57 0 top
R26  36.2,17.78 0 top
R27  8.38,29.21 0 top
R28  9.53,42.93 0 top
R29  9.53,41.27 180 top
R30  36.2,22.99 0 top
R31  22.48,52.77 90 top
R32  31.11,41.91 0 top
R33  9.53,44.58 180 top
R34  9.53,46.23 180 top
RTK  8,31.75 0 bottom
RX2-TX2  24.13,55.24 0 bottom
SHLD_NEO  3.43,51.44 270 bottom
SHLD_ZED  3.3,20.95 270 bottom
TP  8,36.83 0 bottom
TX2-RX2  26.67,55.24 0 bottom
U1  20.32,43.18 270 top
U2  39.37,44.45 180 top
U4  22.86,19.05 180 top
U5  3.81,54.61 270 top
U6  3.81,8.89 270 top
U7  27,32.23 90 top
U$1  [#GND#0]  21.59,61.72 270 top
U$2  [#GND#0]  1.78,24.13 0 top
U$3  [#GND#0]  13.97,1.78 90 bottom
U$4  [#GND#1]  13.97,1.78 270 top
U$5  [#GND#1]  1.78,24.13 0 bottom
U$6  [#GND#1]  21.59,61.72 90 bottom
U$7  [#SHLD_ZED#15]  3.3,15.88 90 bottom
U$8  [#SDA#0]  16.51,61.72 270 top
U$9  [#SCL#0]  21.59,1.78 90 bottom
U$10  [#SDA#0]  19.05,1.78 90 bottom
U$11  [#SDA#1]  19.05,1.78 270 top
U$12  [#SDA#1]  16.51,61.72 90 bottom
U$13  [#SCL#0]  13.97,61.72 270 top
U$14  [L#BAND18]  38.23,37.08 0 top
U$15  [#SCL#1]  13.97,61.72 90 bottom
U$16  [#RTK#0]  1.78,31.75 0 top
U$17  [#RTK#1]  1.78,31.75 0 bottom
U$18  [#GEO#0]  1.78,34.29 0 top
U$19  [#GEO#1]  1.78,34.29 0 bottom
U$20  [#5V#0]  1.78,29.21 0 top
U$21  [#5V#6]  1.78,29.21 0 bottom
U$22  [#3V3#0]  19.05,61.72 270 top
U$23  [#3V3#0]  16.51,1.78 90 bottom
U$24  [#3V3#4]  19.05,61.72 90 bottom
U$25  [#3V3#4]  16.51,1.78 270 top
U$26  [#TP#0]  1.78,36.83 0 top
U$27  [#TP#1]  1.78,36.83 0 bottom
U$28  [#TX_RDY#0]  1.78,39.37 0 top
U$29  [#TX_RDY#1]  1.78,39.37 0 bottom
U$30  [#SCL#1]  21.59,1.78 270 top
U$31  [#TX2#0]  26.67,54.61 90 bottom
U$32  [#RX2#0]  24.13,54.61 90 bottom
U$33  [L1#L218]  38.23,38.23 0 top
U$34  [#RX2#0]  24.13,1.78 270 top
U$35  [#RX2#0]  26.67,61.72 90 bottom
U$36  [#RX2#3]  26.67,61.72 270 top
U$37  [#RX2#3]  24.13,1.78 90 bottom
U$39  [#TX2#0]  26.67,1.78 270 top
U$40  [#TX2#0]  24.13,61.72 90 bottom
U$41  [#TX2#3]  24.13,61.72 270 top
U$42  [#TX2#3]  26.67,1.78 90 bottom
U$43  [#RX1#0]  29.21,1.78 270 top
U$44  [#RX1#0]  31.75,61.72 90 bottom
U$45  [##RESET##0]  36.83,1.78 270 top
U$46  [##RESET##1]  36.83,1.78 90 bottom
U$47  [#EXT_INT#0]  34.29,1.78 270 top
U$48  [#EXT_INT_ZED#0]  34.29,1.78 90 bottom
U$49  [#RX1#2]  31.75,61.72 270 top
U$50  [#RX1#2]  29.21,1.78 90 bottom
U$51  [#TX1#0]  31.75,1.78 270 top
U$52  [#I�C#0]  10.48,53.34 90 bottom
U$53  [#SHLD_NEO#12]  3.43,46.23 90 bottom
U$54  [ANTENNA18]  38.1,36.07 0 top
U$55  [NEO#D9S16]  24.38,31.88 90 bottom
U$56  [#3V3#0]  1.78,26.67 0 top
U$57  [#TX1#0]  29.21,61.72 90 bottom
U$58  [#ANT_PWR#0]  36.83,61.72 90 bottom
U$59  [#ANT_PWR#1]  36.83,61.72 270 top
U$60  [#TX1#2]  29.21,61.72 270 top
U$61  [#TX1#2]  31.75,1.78 90 bottom
U$62  [#EXT_INT_NEO#0]  34.29,61.72 270 top
U$63  [#EXT_INT_NEO#1]  34.29,61.72 90 bottom
U$64  [COMBO16]  22.48,31.88 90 bottom
U$65  [ZED#F9P10]  1.14,7.62 270 top
U$66  [NEO#D9S10]  1.14,55.63 270 top
U$67  [BREAKOUT17]  20.32,31.88 90 bottom
U$68  [SFE_LOGO_NAME_.2]  30.48,31.88 90 bottom
U$69  [#PWR#0]  8.89,26.67 0 bottom
U$70  [#3V3#4]  1.78,26.67 0 bottom
U$71  [##SAFEBOOT#_NEO#13]  12.7,41.27 90 bottom
U$72  [##SAFEBOOT#_ZED#14]  35.56,27.18 90 bottom
U$73  [OPEN_JUMPERS13]  22.23,50.93 90 bottom
U$74  [TO_ISOLATE_UART214]  20.83,50.93 90 bottom
U$75  [ZED#F9P_NEO#D9S_COMBO_BREAKOUT0]  23.75,28.57 0 top
U$76  [DEF_ADDRESS#_12]  9.14,53.34 90 bottom
U$78  [ZED#F9P16]  26.92,31.88 90 bottom
U$79  [NEO#D9S#13]  7.87,51.05 90 bottom
U$80  [ZED#F9P#13]  6.6,51.18 90 bottom
U$81  [0X4313]  7.87,56.77 90 bottom
U$82  [0X4213]  6.6,56.77 90 bottom
USB-NEO  6.35,46.99 270 top
USB-ZED  6.35,16.51 270 top
V_BKCP  33.02,45.72 0 bottom

### Tracks (layer width: path | path; a pad name or v marks a point on that pad's centre or on a via)
3.3V  (via drill 0.3)
  Top 0.508: J9.2 v19.05,56.77 | 9.39,56.65 J2.2 v9.39,59.63 v9.4,59.64 | 9.39,56.65 v10.16,55.88 | J5.2 3.81,26.67 v5.08,25.4 | R1.2 v10.79,24.13 | v8.64,55.88 8.64,55.9 9.39,56.65 | v14.35,47.75 14.42,47.82 U1.23 14.42,50.74 14.86,51.18 C3.1 | U1.22 15.52,47.85 v15.62,47.75 | C4.1 37.88,41.91 v37.21,41.91 D3.A | C4.1 C5.2 v37.34,39.37 | C4.1 39.37,42.12 39.37,42.8 39.72,43.15 U2.5 41.24,43.15 v41.27,43.18 | U4.38 26.71,10.2 v26.67,10.16 26.04,9.53 C8.2 | v19.85,38.62 19.92,38.55 U1.7 19.92,36.59 20.77,35.75 C6.1 C11.2 | v8.38,3.94 J4.2 | C9.1 20.89,9.84 v21.21,10.16 U4.33 | U4.34 22.31,10.2 v22.35,10.16 22.48,10.03 C10.2 | R27.2 v10.54,29.21
  Bottom 0.508: I2C.2 v12.7,54.71
  pour Route15 (isolate 0.203, rank 4): 0,0 0,63.5 43.18,63.5 43.18,0
5V  (via drill 0.3)
  Top 0.406: v41.91,50.8 v41.91,49.53 41.79,49.65 D6.C | D5.C D6.C | D6.C 40.64,48.05 C2.1 40.32,47.52 U2.1 40.32,44.38 40.04,44.11 38.82,44.11 38.42,44.51 U2.3
  Route15 0.406: J5.3 3.05,30.99 3.05,38.86 3.81,39.62 3.81,45.47 2.64,46.64 2.64,51.97 1.78,52.83 1.78,56.52 3.96,58.7 38.58,58.7 41.91,55.36 v41.91,50.8 v41.91,49.53
!RESET!  (via drill 0.3)
  Top 0.152: U1.8 22.92,36.15 v23.33,35.74 | v34.23,20.13 32.83,20.13 U4.49
  Bottom 0.152: 33.02,11.43 34.23,12.64 v34.23,20.13 | v23.33,35.74 22.95,35.36 22.95,30.73 20.7,28.49 15.19,28.49 14.48,27.77 14.48,11.31 16.75,9.04 23.65,9.04 24.03,9.43 24.03,10.36 25.1,11.43 33.02,11.43 | 33.02,11.43 36.83,7.62 J8.6
!SAFEBOOT_NEO!
  Top 0.152: U1.1 13.32,36.69 12.7,36.07 !SAFEBOOT_NEO!.1
!SAFEBOOT_ZED!
  Top 0.152: U4.50 34.63,21.25 !SAFEBOOT_ZED!.1
ANT
  Top 0.318: U7.2 30.91,31.6 C7.2
ANT_NEO
  Top 0.318: U1.11 26.19,37.15 26.19,36.12 arc-90 25.5,35.43 24.89,35.43 arc90 24.2,34.74 U7.5
ANT_PWR  (via drill 0.3)
  Top 0.406: v35.99,34.9 L1.2
  Bottom 0.406: J7.6 36.83,54.61 35.84,53.62 35.84,37.06 35.99,36.91 v35.99,34.9
ANT_VCC
  Top 0.318: FB1.2 32.82,36.37 C1.1
  Top 0.406: C1.1 R14.1
ANT_ZED
  Top 0.318: U4.2 28.91,28.24 arc90 27.94,29.21 24.77,29.21 arc-90 24.26,29.72 24.26,30.27 arc90 U7.8
D+_NEO  (via drill 0.3)
  Top 0.203: R9.1 19.24,32.65 18.54,31.95 v18.54,31.62 | USB-NEO.A6 5.08,47.24 | 5.08,47.24 4.32,47.24 3.42,48.15 3.42,53.54 4.25,54.38 4.25,55.12 4.7,55.56 U5.6 6.19,55.56 v6.35,55.4 | USB-NEO.B6 5.32,46.24 5.08,46.48 5.08,47.24
  Bottom 0.203: v18.54,31.62 18.41,31.75 18.41,41.55 9.07,50.9 9.07,52.65 6.35,55.37 v6.35,55.4
D+_ZED  (via drill 0.3)
  Top 0.203: R15.1 v29.21,6.35 | USB-ZED.A6 6.74,16.76 6.99,16.51 6.99,16 6.74,15.76 USB-ZED.B6 4.1,15.76 3.81,15.47 3.81,11.61 5.18,10.23 U6.6 6.16,9.84 v6.66,9.35
  Bottom 0.203: v29.21,6.35 28.48,6.35 28.01,6.82 8,6.82 6.86,7.96 6.86,9.14 v6.66,9.35
D-_NEO  (via drill 0.3)
  Top 0.203: R10.1 v17.72,31.62 | USB-NEO.A7 6.74,46.74 6.92,46.93 6.92,47.5 6.68,47.74 USB-NEO.B7 4.29,47.74 3.79,48.24 3.79,53.45 4,53.66 U5.4 6.31,53.66 v6.81,54.15
  Bottom 0.203: v17.72,31.62 18.07,31.98 18.07,41.41 8.73,50.75 8.73,52.45 7.1,54.09 6.87,54.09 v6.81,54.15
D-_ZED  (via drill 0.3)
  Top 0.203: R16.1 v27.62,6.25 | USB-ZED.A7 4.89,16.26 | 4.89,16.26 4.13,16.26 3.48,15.61 3.48,11.43 3.65,11.27 4.19,10.72 4.19,8.51 4.76,7.94 U6.4 6.25,7.94 v6.29,7.98 | USB-ZED.B7 5.13,17.26 4.89,17.02 4.89,16.26
  Bottom 0.203: v6.29,7.98 7.79,6.48 27.39,6.48 v27.62,6.25
EXT_INT_NEO
  Top 0.152: R31.2 32.03,53.62 34.29,55.88 J7.5
EXT_INT_ZED  (via drill 0.3)
  Top 0.152: R30.2 39.62,20.41 39.62,7.56 36.91,4.85 v35.59,4.85
  Bottom 0.152: v35.59,4.85 34.29,3.55 J8.5
GEO  (via drill 0.3)
  Top 0.152: R28.2 10.41,42.93 11.43,41.91 11.43,39.37 10.16,38.1 7.03,38.1 6.16,37.23 6.16,34.29 | 6.16,34.29 v6.16,33.02 | J5.5 6.16,34.29 | R24.2 7.51,21.46 6.67,22.3 6.67,25.08 v7.05,25.46
  Bottom 0.152: v7.05,25.46 6.16,26.35 v6.16,33.02
GND  (via drill 0.3)
  Top 0.406: U2.2 v39.37,44.74
  Top 0.508: v10.39,59.64 J2.1 10.39,56.92 v11.43,55.88
  other vias: 25.4,31.75 28.32,32.89 28.32,30.35 25.4,30.48 25.4,33.02 27.3,35.43 28.32,34.16 27.81,28.07 26.16,28.07 29.97,28.19 31.24,29.84 33.91,29.59 34.32,35.66 40.64,27.94 38.1,27.94 36.83,29.21 35.37,29.59 40.64,35.56 38.1,35.56 25.15,38.67 27.43,38.67 30.48,36.13 34.29,38.1 33.02,40.64 30.48,40.64 27.94,40.64 25.4,40.64 23.37,40.64 23.24,28.57 31.24,26.67 16.38,23.18 20.76,23.18 24.96,23.18 29.15,23.18 29.21,19.05 24.89,19.05 20.76,19.05 15.24,19.05 29.15,14.92 24.96,14.92 20.7,14.92 16.51,14.67 31.62,19.05 19.88,10.16 25.46,10.16 30.04,10.16 15.68,27.94 17.91,27.94 31.24,34.35 34.23,33.4 35.43,26.8 8.06,27.94 8.06,33.02 8.06,35.56 11.62,46.23 11.62,44.58 13.4,47.75 14.8,54.86 27.37,47.75 36.83,48.26 36.83,46.99 41.53,41.27 41.53,39.37 31.75,49.53 7.43,3.81 6.35,5.08 19.9,7.7 24.89,7.7 6.99,19.81 6.99,13.27 11.43,15.37 11.43,18.29 20.13,31.69 1.02,4.32 15.24,59.69 25.4,59.69 29.21,55.88 31.75,55.88 15.24,45.72 20.32,45.72 22.86,45.72 27.94,45.72 27.94,43.18 22.86,43.18 20.32,43.18 13.97,43.18 13.97,39.37 15.24,39.37 20.32,40.64 40.46,21.18 36.83,19.05 40.64,16.89 40.64,12.7 40.64,7.62 35.56,10.16 33.02,3.81 25.4,3.81 8.89,1.3 13.97,8.89 8.89,62.23 29.21,50.8 8.89,39.37 17.78,19.05 23.6,7.7 25.4,34.16 28.32,31.62 32.89,31.11 7.71,43.76 1.21,52.55 5.58,52.37 9.06,16.81 7.51,22.83 33.6,9.8 35.79,7.37 5.58,24.84 3.56,8.89 3.68,54.61 6.99,10.03 10.85,11.23 10.08,3.94 7.65,59.74 11.73,50.65 4.42,41.88 1.3,41.25 30.85,7.11 25.4,52.1 15.94,56.11 19.81,56.77 18.24,56.74 17.86,59.74 6.86,55.88 6.99,53.34 5.97,7.24 23.47,10.11 40.61,5.16 40.64,25.4 38.1,25.4 34.29,25.4 34.29,39.37 8.51,7.49 21.46,54.99 21.72,50.42 8.9,25.25
  pour Top (isolate 0.203, rank 4): 0,63.5 43.18,63.5 43.18,0 0,0
  pour Bottom (isolate 0.203, rank 4): 0,63.5 43.18,63.5 43.18,0 0,0
  pour Top (isolate 0.127): 22.86,40.64 22.86,24.13 43.18,24.13 43.18,40.64
  pour Route2 (isolate 0.203, rank 4): 0,63.5 43.18,63.5 43.18,0 0,0
N$1  (via drill 0.3)
  Top 0.152: v8,25.27 7.53,24.8 R1.1
  Bottom 0.152: v8,25.27 7.48,25.79 PWR\.2
N$2
  Top 0.152: U1.20 17.72,51.73 R3.1
N$3
  Top 0.152: R2.1 20.95,50.67 19.92,49.64 U1.18
N$4
  Top 0.152: R4.1 19.43,51.05 18.82,50.44 U1.19
N$5  (via drill 0.3)
  Top 0.152: R8.2 13.34,51.18 12.95,50.8 v12.7,50.8
  Bottom 0.152: v12.7,50.8 13.51,51.61 I2C.1
N$6
  Top 0.152: U1.21 16.62,51.68 R6.1
N$7
  Top 0.152: USB-ZED.B5 7.14,14.76 7.75,15.37 R12.2
N$8  (via drill 0.3)
  Top 0.152: R7.2 10.77,50.88 v10.72,50.88
  Bottom 0.152: v10.72,50.88 11.89,52.05 I2C.3
N$9
  Top 0.152: USB-ZED.A5 7.03,17.76 7.56,18.29 R13.2
N$10  (via drill 0.3)
  Top 0.152: LED1.A 9.26,25.91 9.64,25.53 v10.16,25.53
  Bottom 0.152: v10.16,25.53 10.16,26.18 9.66,26.67 PWR\.1
N$11
  Top 0.267: U1.6 18.82,35.79 19.24,35.37 R9.2
N$12
  Top 0.267: U1.5 R10.2
  Top 0.406: R10.2
N$13
  Top 0.406: D3.C R32.2
N$14
  Top 0.152: R11.1 14.67,35.31 15.52,36.16 U1.3
N$15
  Top 0.152: R5.1 16.19,35.31 16.62,35.73 U1.4
N$16
  Top 0.267: U4.40 28.91,9.4 R15.2
N$17
  Top 0.267: U4.39 27.81,9.29 R16.2
N$18
  Top 0.152: U4.44 35.3,14.65 R19.1
N$19
  Top 0.152: U4.45 33.97,15.75 34.42,16.19 R20.1
N$20
  Top 0.152: U4.42 32.81,11.77 33.15,11.43 R21.1
N$21
  Top 0.152: U4.43 34.81,13.55 R22.1
N$22
  Top 0.152: U4.46 34.31,16.85 35.24,17.78 R26.1
N$23  (via drill 0.3)
  Top 0.152: v10.79,31.75 LED2.A
  Bottom 0.152: RTK.1 v10.79,31.75
N$24
  Top 0.152: U4.27 11.62,12.45 11.37,12.19 R17.1
N$25
  Top 0.152: U4.26 11.66,13.55 11.43,13.78 R18.1
N$26  (via drill 0.3)
  Top 0.152: v10.79,34.29 LED3.A
  Bottom 0.152: GEO.1 v10.79,34.29
N$27  (via drill 0.3)
  Top 0.152: v10.73,36.83 LED4.A
  Bottom 0.152: TP.1 v10.73,36.83
N$28  (via drill 0.3)
  Top 0.152: R27.1 7.53,30.19 v7.49,30.23
  Bottom 0.152: v7.49,30.23 7.49,31.74 RTK.2
N$29  (via drill 0.3)
  Top 0.152: R28.1 v7.71,42.93
  Bottom 0.152: v7.71,42.93 7.71,42 5.93,40.22 5.93,34.71 6.35,34.29 GEO.2
N$30  (via drill 0.3)
  Top 0.152: R29.1 10.16,41.06 v10.16,39.37
  Bottom 0.152: v10.16,39.37 9.27,38.48 7.87,38.48 7.48,38.09 TP.2
N$31
  Top 0.152: U4.51 33.91,22.35 34.54,22.99 R30.1
N$32
  Top 0.152: R31.1 22.48,51.18 22.92,50.74 U1.17
N$33
  Top 0.152: USB-NEO.B5 6.77,45.24 7.43,44.58 R33.2
N$34
  Top 0.152: USB-NEO.A5 7,48.24 7.62,47.62 7.62,46.42 7.81,46.23 R34.2
N$35
  Top 0.152: U4.20 11.64,20.15 11.37,19.88 R23.1
N$36
  Top 0.152: U4.19 11.77,21.25 11.56,21.46 R24.1
N$37
  Top 0.152: U4.53 35.32,24.55 R25.1
RTK
  Top 0.152: R23.2 8.68,19.9 6.31,22.26 6.31,31.71 6.35,31.75 | J5.4 6.35,31.75 | 6.35,31.75 LED2.C
RXD1_NEO  (via drill 0.3)
  Top 0.152: R6.2 16.38,54.48 18.14,56.24 27.03,56.24 27.94,57.15 v27.94,59.69
  Bottom 0.152: v27.94,59.69 30.48,59.69 31.75,60.96 J7.4
RXD1_ZED  (via drill 0.3)
  Top 0.152: R22.2 38.05,12.01 38.05,7.57 36.81,6.33 30.5,6.33 v30.48,6.35
  Bottom 0.152: v30.48,6.35 30.48,5.08 29.21,3.81 J8.3
RXD2_NEO  (via drill 0.3)
  Top 0.152: R5.2 15.85,32.46 v15.85,30.68
  Bottom 0.152: v15.85,30.68 15.85,30.5 16.7,29.65 20.38,29.65 21.86,31.13 21.86,47.51 26.15,51.8 TX2-RX2.2 26.15,59.17 26.67,59.69 J7.2
RXD2_ZED  (via drill 0.3)
  Top 0.152: R18.2 7.72,12.83 v7.72,9.98 7.72,9.36 13.41,3.67 20.08,3.67 21.21,2.54 22.86,2.54 J8.1
  Bottom 0.152: v7.72,9.98 7.8,9.91 11.92,9.91 13.29,11.27 13.29,29.46 15.07,31.24 16.05,31.24 17.26,30.02 20.26,30.02 21.34,31.1 21.34,47.74 24.65,51.05 RX2-TX2.1
SCL  (via drill 0.3)
  Top 0.152: J9.4 13.97,60.96 13.71,60.7 7.87,60.7 v6.91,59.74 7.39,59.26 J2.4 7.39,55.48 7.9,54.97 11.33,54.97 11.81,54.48 R7.1 | R4.2 v19.43,54.74 | J10.4 19.62,3.24 11.48,3.24 v10.85,3.87 10.84,3.87 10.39,4.32 J4.4 | R20.2 37.15,16.19 38.91,14.43 38.91,7.64 36.93,5.66 34.43,5.66 33.93,5.16 v22.89,5.16
  Bottom 0.152: v19.43,54.74 16.38,54.74 13.97,57.15 J9.4 | v6.91,59.74 5.28,58.12 1.99,58.12 0.84,56.96 0.84,54.25 1.85,53.24 5.44,53.24 6.86,51.82 6.86,42.42 6.1,41.66 4.95,41.66 3.81,40.51 3.81,24.89 7.62,21.08 7.62,12.01 6.27,10.67 2.26,10.67 1.09,9.5 1.09,6.29 2.13,5.25 4.01,5.25 6.7,2.55 9.53,2.55 v10.85,3.87 | v22.89,5.16 21.59,3.87 J10.4
SDA  (via drill 0.3)
  Top 0.152: J9.3 14.45,60.17 8.86,60.17 v8.38,59.69 v8.39,59.68 J2.3 8.39,56.65 7.87,56.13 7.87,55.5 8.13,55.24 13.08,55.24 13.34,54.99 R8.1 | v20.45,55.25 20.45,54.13 R2.2 | J10.3 19.05,2.54 18.81,2.78 10.55,2.78 v9.4,3.94 v9.39,3.94 J4.3 | R19.2 37.15,14.61 38.43,13.32 38.43,7.55 36.85,5.97 34.13,5.97 33.85,5.69 20.89,5.69 v20.38,5.18
  Bottom 0.152: v20.45,55.25 17.14,55.25 16.51,55.88 J9.3 | v9.4,3.94 8.57,3.11 7.15,3.11 4.41,5.86 2.48,5.86 1.7,6.63 1.7,9.31 2.54,10.15 6.36,10.15 8.18,11.96 8.18,21.29 4.39,25.07 4.39,40.21 5.26,41.07 6.12,41.07 7.21,42.16 7.21,44.45 7.59,44.83 7.59,51.59 5.42,53.76 1.99,53.76 1.42,54.33 1.42,56.41 2.54,57.53 6.22,57.53 v8.38,59.69 | v20.38,5.18 19.05,3.84 J10.3
SHIELD_NEO
  Route2 0.406: USB-NEO.SHLD3 USB-NEO.SHLD1 | USB-NEO.SHLD4 USB-NEO.SHLD2
  pour Top (isolate 0.178, no thermals): 0.05,51.33 6.07,51.33 6.07,42.65 0.05,42.65
  pour Bottom (isolate 0.178, no thermals): 6.07,51.33 0.05,51.33 0.05,42.65 6.07,42.65
SHIELD_ZED
  Route2 0.406: USB-ZED.SHLD4 USB-ZED.SHLD2 | USB-ZED.SHLD3 USB-ZED.SHLD1
  pour Top (isolate 0.178, no thermals): 0.05,20.85 6.07,20.85 6.07,12.17 0.05,12.17
  pour Bottom (isolate 0.178, no thermals): 6.07,20.85 0.05,20.85 0.05,12.17 6.07,12.17
SMA
  Top 0.267: D1.1
  Top 0.318: J1.SIG 36.03,31.75 | L1.1 35.64,32.14 D1.1 34.04,32.39 FB1.1 32.56,32.64 31.37,32.64 31.29,32.72 C7.1
  Top 0.813: 36.03,31.75 L1.1
TP  (via drill 0.3)
  Top 0.152: J5.6 v5.08,36.83 5.08,38.61 7.75,41.27 R29.2 | R25.2 39.9,21.72 39.9,7.45 36.8,4.34 14.14,4.34 9.4,9.08 v9.4,11.02
  Bottom 0.152: v9.4,11.02 9.88,11.51 9.88,21.47 5.05,26.3 5.05,36.8 v5.08,36.83
TX_RDY  (via drill 0.3)
  Top 0.152: R26.2 39.34,15.48 39.34,7.68 37.02,5.35 34.56,5.35 33.87,4.66 14.45,4.66 9.78,9.32 9.78,10.62 v10.16,11 | v5.33,40.13 4.57,39.37 J5.7
  Bottom 0.152: v10.16,11 10.16,21.65 5.65,26.16 5.65,39.81 v5.33,40.13
TXD1_NEO
  Top 0.152: R3.2 17.91,54.99 18.67,55.75 27.61,55.75 29.21,57.35 J7.3
TXD1_ZED  (via drill 0.3)
  Top 0.152: R21.2 37.63,10.85 37.63,7.66 36.75,6.78 31.83,6.78 v31.75,6.86
  Bottom 0.152: v31.75,6.86 J8.4
TXD2_NEO  (via drill 0.3)
  Top 0.152: R11.2 v14.67,31.62
  Bottom 0.152: v14.67,31.62 14.7,31.66 16.2,31.66 17.38,30.48 20.04,30.48 20.85,31.29 20.85,48.16 23.61,50.91 RX2-TX2.2 23.61,59.17 24.13,59.69 J7.1
TXD2_ZED  (via drill 0.3)
  Top 0.152: R17.2 v8.68,9.37 8.68,9.14 13.77,4.05 20.42,4.05 21.25,3.23 24.71,3.23 J8.2
  Bottom 0.152: v8.68,9.37 8.75,9.3 12.09,9.3 13.74,10.95 13.74,28.76 14.18,29.2 20.45,29.2 22.34,31.09 22.34,47.16 27.19,52.01 TX2-RX2.1
V_BKCP  (via drill 0.3)
  Top 0.152: R32.1 v29.21,41.91 | v24.54,10.13 24.54,11.57 U4.36
  Top 0.406: R32.1 30.27,43.65 BT1.+
  Bottom 0.152: v24.54,10.13 24.54,9.3 24,8.76 16.64,8.76 14.2,11.2 14.2,28.52 14.47,28.79 20.61,28.79 22.67,30.84 22.67,41.47 23.11,41.91 v29.21,41.91 29.21,44.45 30.48,45.72 V_BKCP.1
V_USB  (via drill 0.3)
  Top 0.203: U6.5 6.14,8.89 v6.35,8.68
  Top 0.406: D5.A v38.1,53.34 v38.1,54.61 | USB-ZED.VBUS2 5.5,14.06 v4.83,14.73 | USB-ZED.VBUS1 5.5,18.96 v4.83,18.29
  Route15 0.406: v38.1,53.34 v38.1,54.61 38.1,55.88 36.6,57.38 10.39,57.38 9.4,56.39 9.4,42.42 4.34,37.36 4.34,23.39 3.81,22.86 3.81,18.85 | v4.83,14.73 3.81,14.73 | 3.81,14.73 3.81,17.78 | 3.81,17.78 3.81,18.29 | 3.81,18.29 3.81,18.85 | v4.83,18.29 4.37,18.29 | 4.32,18.29 3.81,18.29 | 3.81,14.73 3.17,14.1 3.17,11.75 6.24,8.68 v6.35,8.68 | 3.81,17.78 4.32,18.29 | 4.32,18.29 4.37,18.29 | 3.81,18.85 4.37,18.29
V_USB_2  (via drill 0.3)
  Top 0.203: U5.5 5.24,54.66 v6.34,54.66
  Top 0.406: D6.A v40.64,53.34 v40.64,54.61 | USB-NEO.VBUS2 5.5,44.54 v4.95,45.09 | USB-NEO.VBUS1 5.5,49.44 v4.95,48.9
  Route15 0.406: v40.64,53.34 v40.64,54.61 40.64,55.88 38.48,58.04 5.54,58.04 4.41,56.91 | v4.95,45.09 3.17,46.86 3.17,48.39 | 3.17,48.39 3.17,48.9 | v4.95,48.9 3.68,48.9 | 3.68,48.9 3.17,48.9 | 4.41,56.91 4.19,56.69 | 4.19,56.69 3.98,56.48 | 3.98,56.48 2.31,54.81 2.31,53.05 3.17,52.19 3.17,49.53 | 3.17,49.53 3.17,48.9 | 3.17,48.39 3.68,48.9 | 3.17,49.53 3.68,49.02 3.68,48.9 | 4.41,56.48 6.22,54.66 v6.34,54.66 | 4.19,56.69 4.41,56.48 | 4.41,56.48 4.41,56.91 | 4.41,56.48 3.98,56.48
VCC_RF
  Top 0.406: R14.2 29.88,39.37 24.77,39.37 24,38.61 24,37.2 U1.9

### Text on the board
Top: 1
Route2: 2
Route15: 3
Bottom: v10 | 4
Milling: Route Out
Measures: Measurements in inches
tDocu: 1.6mm Thickness / 4-Layers / 1oz Copper / 0.5oz Inner Copper / Stackup: JLC7628 / Material: TG135-140 / Lead-Free HASL finish / Red soldermask / White silkscreen | Paul Clark | Revised By: Elias Santistevan